# EasyEDA Pro project forkGuard sensor board.eprj

# Schematic SDS Board
Create Date: 2026-02-13; Page Name: P2; Project Name: forkGuard sensor board; Schematic Name: SDS Board; Update Date: 2026-02-13; Company: EasyEDA.com; Page Size: A4; Version: V1.0
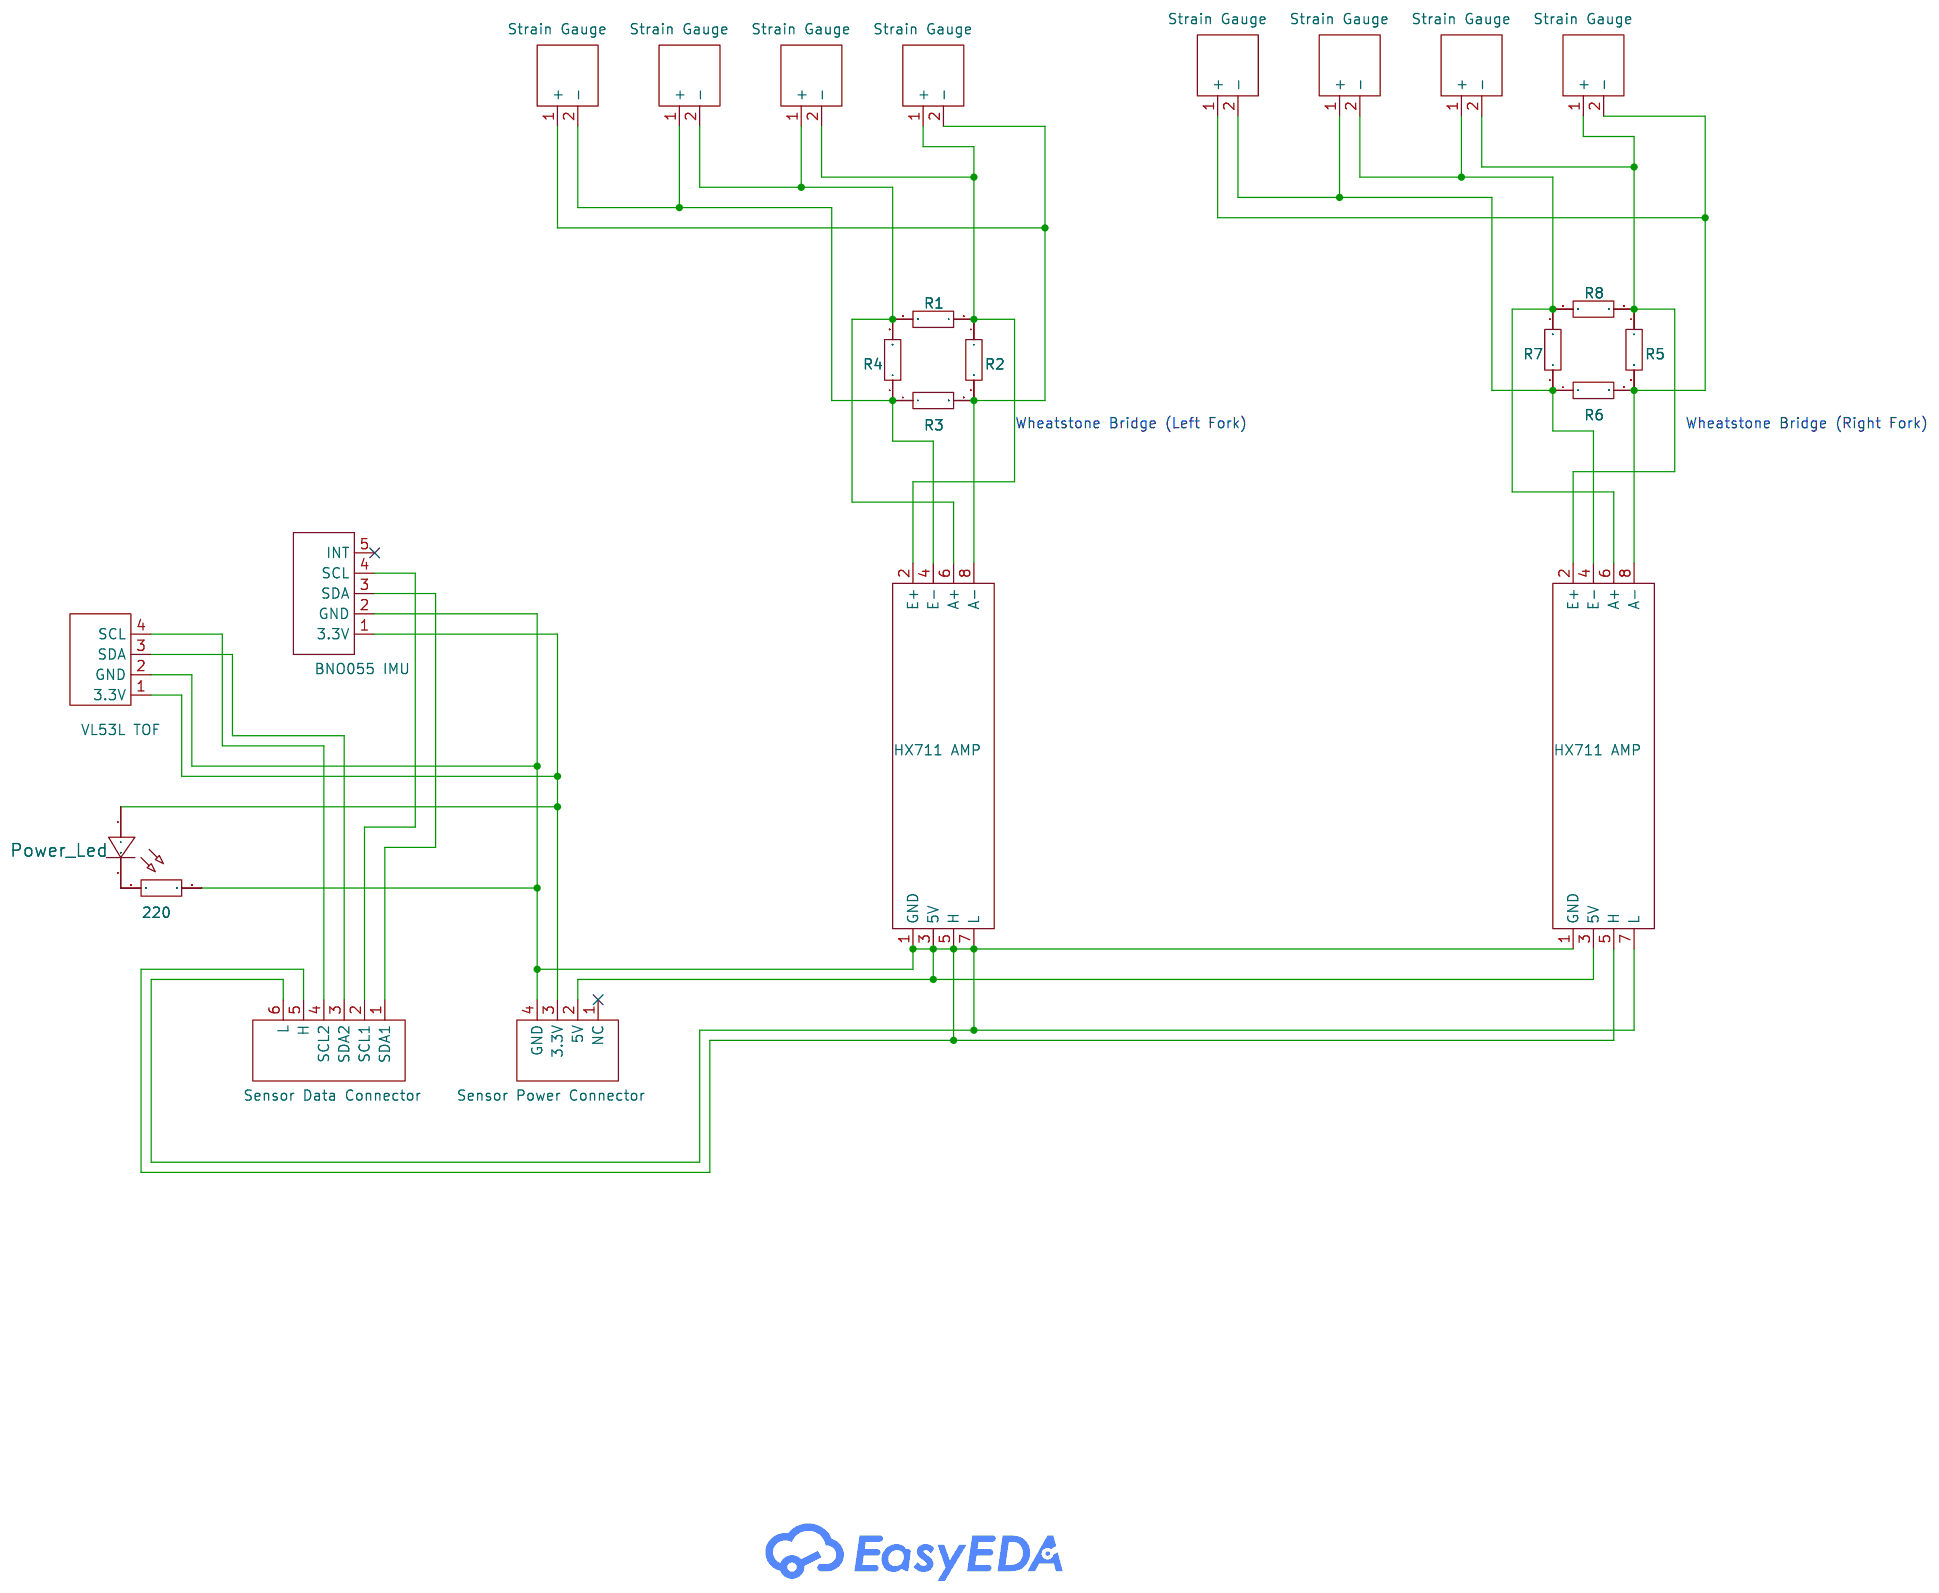
[diagram p0: schematic sheet]

## Parts
H1  Sensor Data Connector  [HDR-TH_TW-06-01-T-S-150-085]
H2  Sensor Power Connector  [HDR-TH_TW-04-06-T-S-433-120]
H3  BNO055 IMU  [HDR-TH_TW-05-01-T-S-187-070]
H4  HX711 AMP  [HDR-TH_8P-P2.00-V-M-R2-C4-S2.00-2]
H5  HX711 AMP  [HDR-TH_8P-P2.00-V-M-R2-C4-S2.00-2]
H6  VL53L TOF  [HDR-TH_4P-P2.00-V-M_TW-04-02-T-S-195-090]
H11  Strain Gauge  [HDR-TH_TW-02-03-G-S-245-155]
H12  Strain Gauge  [HDR-TH_TW-02-03-G-S-245-155]
H13  Strain Gauge  [HDR-TH_TW-02-03-G-S-245-155]
H14  Strain Gauge  [HDR-TH_TW-02-03-G-S-245-155]
H15  Strain Gauge  [HDR-TH_TW-02-03-G-S-245-155]
H16  Strain Gauge  [HDR-TH_TW-02-03-G-S-245-155]
H17  Strain Gauge  [HDR-TH_TW-02-03-G-S-245-155]
H18  Strain Gauge  [HDR-TH_TW-02-03-G-S-245-155]
Power_Led  -  [LED0402-RD_YELLOW]
R1  10K  [R0603]
R2  10K  [R0603]
R3  10K  [R0603]
R4  10K  [R0603]
R5  10K  [R0603]
R6  10K  [R0603]
R7  10K  [R0603]
R8  10K  [R0603]
R9  10K  [R0603]

## Library data of the parts
H1 = TW-06-08-L-S-580-150: Supplier Part: C20390239; Manufacturer: SAMTEC; JLCPCB Part Class: Extended Part; Datasheet: https://item.szlcsc.com/datasheet/TW-06-08-L-S-580-150/21715804.html; Supplier: LCSC
H2 = TW-04-05-L-S-275-158: Supplier Part: C20387770; Manufacturer: SAMTEC; JLCPCB Part Class: Extended Part; Datasheet: https://item.szlcsc.com/datasheet/TW-04-05-L-S-275-158/21713333.html; Supplier: LCSC
H3 = TW-05-01-T-S-187-070: Pitch:2mm Mounting Type:Through Hole Number of Rows:1 Number of Pins:5P Contact Plating:Tin Color:Black; LCSC Part Name: 间距:2mm 直插; Supplier Part: C6003266; Manufacturer: SAMTEC; Supplier Footprint: 插件,P=2mm; JLCPCB Part Class: Extended Part; Datasheet: https://item.szlcsc.com/datasheet/TW-05-01-T-S-187-070/6941581.html; Supplier: LCSC; Pitch: 2mm; Mounting Type: Through Hole; Number of Rows: 1; Number of Pins: 5P; Contact Plating: Tin; Color: Black
H4 H5 = TW-04-04-L-D-277-109: Pitch:2mm Row Spacing:2mm Mounting Type:Through Hole Number of Rows:2 Number of Pins:8P Contact Plating:Gold Color:Black; LCSC Part Name: 间距:2mm 直插; Supplier Part: C6342595; Manufacturer: SAMTEC; Supplier Footprint: 插件,P=2mm; JLCPCB Part Class: Extended Part; Datasheet: https://item.szlcsc.com/datasheet/TW-04-04-L-D-277-109/7291470.html; Supplier: LCSC; Pitch: 2mm; Row Spacing: 2mm; Mounting Type: Through Hole; Number of Rows: 2; Number of Pins: 8P; Contact Plating: Gold; Color: Black
H6 = TW-04-02-L-S-125-100: Pitch:2mm Mounting Type:Through Hole Number of Rows:1 Number of Pins:4P Contact Plating:Gold Color:Black; LCSC Part Name: 间距:2mm 直插; Supplier Part: C6342574; Manufacturer: SAMTEC; Supplier Footprint: 插件,P=2mm; JLCPCB Part Class: Extended Part; Datasheet: https://item.szlcsc.com/datasheet/TW-04-02-L-S-125-100/7291449.html; Supplier: LCSC; Pitch: 2mm; Mounting Type: Through Hole; Number of Rows: 1; Number of Pins: 4P; Contact Plating: Gold; Color: Black
H11-H18 = TW-02-03-G-S-245-155: Supplier Part: C20385850; Manufacturer: SAMTEC; JLCPCB Part Class: Extended Part; Datasheet: https://item.szlcsc.com/datasheet/TW-02-03-G-S-245-155/21711413.html; Supplier: LCSC
Power_Led = LED_0402-R: Supplier Footprint: 0402
R1-R9 = Res_0603: Supplier Footprint: 0603

## Nets
Net-(H1-1): H1.1(SDA1) H3.3(SDA)
Net-(H1-2): H1.2(SCL1) H3.4(SCL)
Net-(H1-3): H1.3(SDA2) H6.3(SDA)
Net-(H1-4): H1.4(SCL2) H6.4(SCL)
Net-(H1-5): H1.5(H) H1.6(L) H2.2(5V) H2.4(GND) H3.2(GND) H4.1(GND) H4.3(5V) H4.5(H) H4.7(L) H5.1(GND) H5.3(5V) H5.5(H) H5.7(L) H6.2(GND) R9.2
Net-(H2-3): H2.3(3.3V) H3.1(3.3V) H6.1(3.3V) Power_Led.1(A)
Net-(H4-2): H4.2(E+) H15.1(+) H16.2(-) R5.1 R8.1
Net-(H4-4): H4.4(E-) H17.1(+) H18.2(-) R6.1 R7.1
Net-(H4-6): H4.6(A+) H16.1(+) H17.2(-) R7.2 R8.2
Net-(H4-8): H4.8(A-) H15.2(-) H18.1(+) R5.2 R6.2
Net-(H5-2): H5.2(E+) H11.1(+) H12.2(-) R1.1 R2.1
Net-(H5-4): H5.4(E-) H13.1(+) H14.2(-) R3.1 R4.1
Net-(H5-6): H5.6(A+) H12.1(+) H13.2(-) R1.2 R4.2
Net-(H5-8): H5.8(A-) H11.2(-) H14.1(+) R2.2 R3.2
Net-(Power_Led-2): Power_Led.2(C) R9.1

Not connected (* = marked no-connect by the designer): H2 1(NC)*; H3 5(INT)*

## Notes on the sheet
- Wheatstone Bridge (Left Fork)
- Wheatstone Bridge (Right Fork)
